# Altium project iCE_Vision.PrjPcb
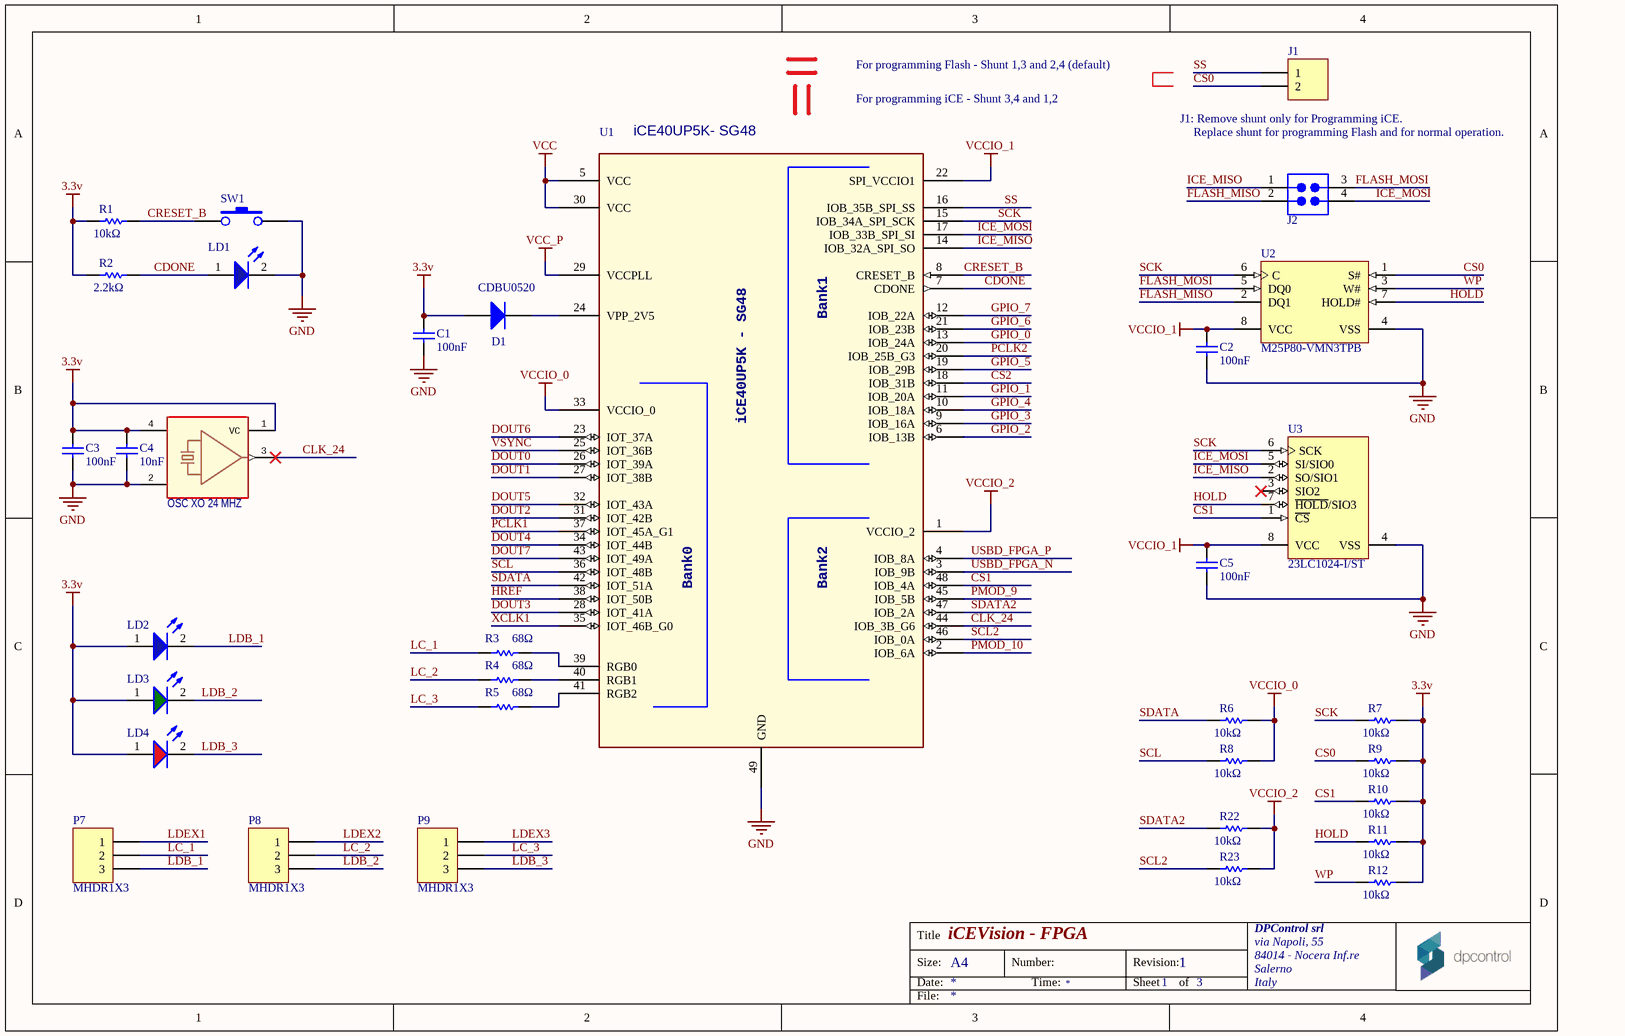
[diagram p0: FPGA.SchDoc]
Address1: via Napoli, 55
3 sheets, 106 parts. Net scope: global (net labels, ports and power ports of the same name join across sheets).
Board file: DPC_ICE_UP.PcbDoc
Sheets:
  FPGA.SchDoc
  POWER.SchDoc
  HEADER.SchDoc

## Sheet FPGA.SchDoc: iCEVision - FPGA
size A4; Organization: DPControl srl; Address1: via Napoli, 55; Address2: 84014 - Nocera Inf.re; Address3: Salerno; Address4: Italy; Revision: 1; SheetNumber: 1; SheetTotal: 3

### Parts
C1  value 100nF  [0603]  (hidden comment: C0603)
C2  value 100nF  [0603]  (hidden comment: C0603)
C3  value 100nF  [0603]  (hidden comment: C0603)
C4  value 10nF  [0603]  (hidden comment: C0603)
C5  value 100nF  [0603]  (hidden comment: C0603)
D1  value CDBU0520  [0603]  (hidden comment: Diode)
J1  WE-2.54 mm Pin Header & Jumper 61300211121  [61300211121]  (value not drawn)
J2  WE-2.54 mm Pin Header & Jumper 61300421121  [61300421121]  (value not drawn)
LD1  150060BS75000  [LED_0603_Blue]  (value not drawn)
LD2  150060BS75000  [LED_0603_Blue]  (value not drawn)
LD3  150060GS75000  [LED_0603_Green]  (value not drawn)
LD4  150060RS75000  [LED_0603_Red]  (value not drawn)
OSC1  OSC XO 24 MHZ  [3.4X2.7-4-PAD]
P7  MHDR1X3  [MHDR1X3]
P8  MHDR1X3  [MHDR1X3]
P9  MHDR1X3  [MHDR1X3]
R1  value 10kΩ  [3-0603]  (hidden comment: ERJ3EK)
R2  value 2.2kΩ  [3-0603]  (hidden comment: ERJ3EK)
R3  value 68Ω  [3-0603]  (hidden comment: ERJ3EK)
R4  value 68Ω  [3-0603]  (hidden comment: ERJ3EK)
R5  value 68Ω  [3-0603]  (hidden comment: ERJ3EK)
R6  value 10kΩ  [3-0603]  (hidden comment: ERJ3EK)
R7  value 10kΩ  [3-0603]  (hidden comment: ERJ3EK)
R8  value 10kΩ  [3-0603]  (hidden comment: ERJ3EK)
R9  value 10kΩ  [3-0603]  (hidden comment: ERJ3EK)
R10  value 10kΩ  [3-0603]  (hidden comment: ERJ3EK)
R11  value 10kΩ  [3-0603]  (hidden comment: ERJ3EK)
R12  value 10kΩ  [3-0603]  (hidden comment: ERJ3EK)
R22  value 10kΩ  [3-0603]  (hidden comment: ERJ3EK)
R23  value 10kΩ  [3-0603]  (hidden comment: ERJ3EK)
SW1  B3U-1000P  [B3U-1000P omron]  (value not drawn)
U1  iCE40UP5K- SG48
U2  M25P80-VMN3TPB  [MICT-MN-8_N]
U3  23LC1024-I/ST  [MCHP-TSSOP-ST8_N]

### Nets
3.3v: C1.2 C3.1 C4.2 D1.1(A) LD2.1(A) LD3.1(A) LD4.1(A) OSC1.1(VC) OSC1.4(VCC) R1.1 R2.1 R7.2 R9.2 R10.2 R11.2 R12.2
GND: C1.1 C2.1 C3.2 C4.1 C5.1 LD1.2(C) OSC1.2(GND) SW1.2 U1.49(GND) U2.4(VSS) U3.4(VSS)
VCC: U1.5(VCC) U1.30(VCC)
VCC_P: U1.29(VCCPLL)
VCCIO_0: R6.2 R8.2 U1.33(VCCIO_0)
VCCIO_1: C2.2 C5.2 U1.22(SPI_VCCIO1) U2.8(VCC) U3.8(VCC)
VCCIO_2: R22.2 R23.2 U1.1(VCCIO_2)
CDONE: LD1.1(A) R2.2 U1.7(CDONE)
CLK_24: OSC1.3(OUT) U1.44(IOB_3B_G6)
CRESET_B: R1.2 SW1.1 U1.8(CRESET_B)
CS0: J1.2 R9.1 U2.1(S#)
CS1: R10.1 U1.48(IOB_4A) U3.1(~{CS})
CS2: U1.18(IOB_31B)
DOUT0: U1.26(IOT_39A)
DOUT1: U1.27(IOT_38B)
DOUT2: U1.31(IOT_42B)
DOUT3: U1.28(IOT_41A)
DOUT4: U1.34(IOT_44B)
DOUT5: U1.32(IOT_43A)
DOUT6: U1.23(IOT_37A)
DOUT7: U1.43(IOT_49A)
FLASH_MISO: J2.2 U2.2(DQ1)
FLASH_MOSI: J2.3 U2.5(DQ0)
GPIO_0: U1.13(IOB_24A)
GPIO_1: U1.11(IOB_20A)
GPIO_2: U1.6(IOB_13B)
GPIO_3: U1.9(IOB_16A)
GPIO_4: U1.10(IOB_18A)
GPIO_5: U1.19(IOB_29B)
GPIO_6: U1.21(IOB_23B)
GPIO_7: U1.12(IOB_22A)
HOLD: R11.1 U2.7(HOLD#) U3.7(~{HOLD}/SIO3)
HREF: U1.38(IOT_50B)
ICE_MISO: J2.1 U1.14(IOB_32A_SPI_SO) U3.2(SO/SIO1)
ICE_MOSI: J2.4 U1.17(IOB_33B_SPI_SI) U3.5(SI/SIO0)
LC_1: P7.2 R3.1
LC_2: P8.2 R4.1
LC_3: P9.2 R5.1
LDB_1: LD2.2(C) P7.3
LDB_2: LD3.2(C) P8.3
LDB_3: LD4.2(C) P9.3
LDEX1: P7.1
LDEX2: P8.1
LDEX3: P9.1
PCLK1: U1.37(IOT_45A_G1)
PCLK2: U1.20(IOB_25B_G3)
PMOD_9: U1.45(IOB_5B)
PMOD_10: U1.2(IOB_6A)
SCK: R7.1 U1.15(IOB_34A_SPI_SCK) U2.6(C) U3.6(SCK)
SCL: R8.1 U1.36(IOT_48B)
SCL2: R23.1 U1.46(IOB_0A)
SDATA: R6.1 U1.42(IOT_51A)
SDATA2: R22.1 U1.47(IOB_2A)
SS: J1.1 U1.16(IOB_35B_SPI_SS)
USBD_FPGA_N: U1.3(IOB_9B)
USBD_FPGA_P: U1.4(IOB_8A)
VSYNC: U1.25(IOT_36B)
WP: R12.1 U2.3(W#)
XCLK1: U1.35(IOT_46B_G0)
NetD1_2: D1.2(K) U1.24(VPP_2V5)
NetR3_2: R3.2 U1.39(RGB0)
NetR4_2: R4.2 U1.40(RGB1)
NetR5_2: R5.2 U1.41(RGB2)

Not connected (* = marked no-connect by the designer): U3 3(SIO2)*

### Notes on the sheet
- For programming Flash - Shunt 1,3 and 2,4 (default)
- For programming iCE - Shunt 3,4 and 1,2
- (near J1) J1: Remove shunt only for Programming iCE.
- Replace shunt for programming Flash and for normal operation.
- Title
- Size:
- Date:
- A4
- Number:
- Time:
- Revision:
- Sheet
- of
- File:
- (in symbol iCE40UP5K- SG48) Bank1; iCE40UP5K - SG48; Bank0; Bank2

### Library data of the parts
C1-C3 C5 = C0603: Ceramic Chip Capacitor - Standard; Part No: C0603C104K8RACTU; MPN: GPC0603104; Note: Footprint corresponds to dimensions for bulk cassette packaging. This case size has tightened tolerances.; Published: 17-Jul-2002; LatestRevisionNote: Silkscreen size reduced.; DatasheetDocument: Mar-2001; PackageDocument: Mar-2001; PackageReference: 0603; Publisher: Altium Limited; Code_JEITA: 0603; Code_IPC: 1608 [0603]; ComponentLink1Description: Manufacturer Link; ComponentLink1URL: http://www.kemet.com/; ComponentLink2Description: Datasheet; ComponentLink2URL: http://www.kemet.com/kemet/web/homepage/kechome.nsf/vapubfilesname/F3102TA.pdf/$file/F3102TA.pdf
C4 = C0603: Ceramic Chip Capacitor - Standard; Part No: C0603C103K5RACTU; MPN: GPC0603103; Note: Footprint corresponds to dimensions for bulk cassette packaging. This case size has tightened tolerances.; Published: 17-Jul-2002; LatestRevisionNote: Silkscreen size reduced.; DatasheetDocument: Mar-2001; PackageDocument: Mar-2001; PackageReference: 0603; Publisher: Altium Limited; Code_JEITA: 0603; Code_IPC: 1608 [0603]; ComponentLink1Description: Manufacturer Link; ComponentLink1URL: http://www.kemet.com/; ComponentLink2Description: Datasheet; ComponentLink2URL: http://www.kemet.com/kemet/web/homepage/kechome.nsf/vapubfilesname/F3102TA.pdf/$file/F3102TA.pdf
D1 = Diode: Default Diode; Manufacturer: COMCHIP TECHNOLOGY; Published: 8-Jun-2000; LatestRevisionDate: 17-Jul-2002; LatestRevisionNote: Re-released for DXP Platform.; PackageVersion: Sep-1996; PackageReference: SOD-523F (0603); Publisher: Altium Limited; PackageDescription: SOD-523F (0603); Code_JEDEC: DO-214-AB; MPN: CDBU0520
J1 = WE-2.54 mm Pin Header & Jumper 61300211121: WR-PHD 2.54mm Pin Header; Manufacturer: W¨¹rth Elektronik eiSos GmbH; ComponentLink1 Description: Manufacturer; ComponentLink2 Description: Datasheet; NoPins: 02; Created Date: 22 March 2013; partNo: 61300211121; ComponentLink1URL: http://www.we-online.com; ComponentLink2URL: http://katalog.we-online.de/em/datasheet/6130xx11121.pdf; Created by: Karrer Zheng
J2 = WE-2.54 mm Pin Header & Jumper 61300421121: WR-PHD 2.54 mm Dual Pin Header; Manufacturer: W¨¹rth Elektronik eiSos GmbH; ComponentLink1 Description: Manufacturer; ComponentLink2 Description: Datasheet; NoPins: 04; Created Date: 25 March 2013; partNo: 61300421121; ComponentLink1URL: http://www.we-online.com; ComponentLink2URL: http://katalog.we-online.de/em/datasheet/6130xx21121.pdf; Created by: Karrer Zheng
LD1 LD2 = WL-SMCW 0603  150060BS75000: SMD mono-color Chip LED, WL-SMCW, Blue; Manufacturer: W黵th Elektronik eiSos GmbH; PartNo: 150060BS75000; ComponentLink1Description: Manufacturer; ComponentLink1URL: http://www.we-online.de; Created by: Christin Otto; Created Date: June 2013; ComponentLink2Description: Datasheet; ComponentLink2URL: http://katalog.we-online.com/led/datasheet/150060BS75000.pdf; Color: Blue; MPN: 150060BS75000
LD3 = WL-SMCW 0603  150060GS75000: SMD mono-color Chip LED, WL-SMCW, Green; Manufacturer: W黵th Elektronik eiSos GmbH; PartNo: 150060GS75000; ComponentLink1Description: Manufacturer; ComponentLink1URL: http://www.we-online.de; Created by: Christin Otto; Created Date: June 2013; ComponentLink2Description: Datasheet; ComponentLink2URL: http://katalog.we-online.com/led/datasheet/150060GS75000.pdf; Color: Green; MPN: 150060GS75000
LD4 = WL-SMCW 0603  150060RS75000: SMD mono-color Chip LED, WL-SMCW, Red; Manufacturer: W黵th Elektronik eiSos GmbH; PartNo: 150060RS75000; ComponentLink1Description: Manufacturer; ComponentLink1URL: http://www.we-online.de; Created by: Christin Otto; Created Date: June 2013; ComponentLink2Description: Datasheet; ComponentLink2URL: http://katalog.we-online.com/led/datasheet/150060RS75000.pdf; Color: Red; MPN: 150060RS75000
OSC1 = TCXO-CFPT-9301: Manufacturer: Abracon LLC; Part No: LFSPXO025558; MPN: 7M-24.000MAAJ-T; Value: ASFL1-24.000MHZ-EK-T; Supplier 1: Allied; Distributor: RS Components
P7-P9 = MHDR1X3: Header, 3-Pin; LatestRevisionDate: 17-Jul-2002; LatestRevisionNote: Re-released for DXP Platform.; Publisher: Altium Limited
R1 R6-R12 R22 R23 = ERJ3EK: Precision Thick Film Chip Resistor, 10 Ohm to 1M Ohm Range, 1% and 0.5% Tolerance, 0603 Size, 0.063 W; Part No: ERJ3EKF1002V; MPN: GPR060310K; Published: 17-Dec-2003; LatestRevisionDate: 19-Mar-2004; LatestRevisionNote: Silkscreen size reduced.; PackageDocument: Mar-2003; PackageReference: 3-0603; Publisher: Altium Limited; Code_IPC: 1608 [0603]; ComponentLink1Description: Manufacturer Link; ComponentLink1URL: http://www.panasonic.com/industrial/components/resistive_products.htm; ComponentLink2Description: Datasheet; ComponentLink2URL: http://www.panasonic.com/industrial/components/pdf/AOA0000CE2.pdf
R2 = ERJ3EK: Precision Thick Film Chip Resistor, 10 Ohm to 1M Ohm Range, 1% and 0.5% Tolerance, 0603 Size, 0.063 W; Part No: ERA3ARB222V; MPN: GPR06032K2; Published: 17-Dec-2003; LatestRevisionDate: 19-Mar-2004; LatestRevisionNote: Silkscreen size reduced.; PackageDocument: Mar-2003; PackageReference: 3-0603; Publisher: Altium Limited; Code_IPC: 1608 [0603]; ComponentLink1Description: Manufacturer Link; ComponentLink1URL: http://www.panasonic.com/industrial/components/resistive_products.htm; ComponentLink2Description: Datasheet; ComponentLink2URL: http://www.panasonic.com/industrial/components/pdf/AOA0000CE2.pdf
R3-R5 = ERJ3EK: Precision Thick Film Chip Resistor, 10 Ohm to 1M Ohm Range, 1% and 0.5% Tolerance, 0603 Size, 0.063 W; Part No: ERJPA3F68R0V; MPN: GPR060368R; LatestRevisionDate: 19-Mar-2004; LatestRevisionNote: Silkscreen size reduced.; PackageDocument: Mar-2003; PackageReference: 3-0603; Publisher: Altium Limited; Code_IPC: 1608 [0603]; ComponentLink1Description: Manufacturer Link; ComponentLink1URL: http://www.panasonic.com/industrial/components/resistive_products.htm; ComponentLink2Description: Datasheet; ComponentLink2URL: http://www.panasonic.com/industrial/components/pdf/AOA0000CE2.pdf
SW1 = SW-PB: Tact Switch; MAN: Omron; DIST: Farnell; DIST PN: 1333652RL; MAN PN: B3U-1000P; ICCO PN: B3U-1000P; MPN: B3U-1000P
U1 = iCE40UP5K- SG48: MPN: ICE40UP5K-SG48ITR50
U2 = M25P80-VMN3TPB: 8 Mb (x1) Automotive Serial NOR Flash Memory, 75 MHz, 2.7 to 3.6 V, 8-pin SO8 Narrow (MN), Tape & Reel; Part Family: M25P; Manufacturer: Micron; MPN: MX25L8006EM2I-12G; Density: 8Mb; Speed: 75 MHz; Voltage: 2.7V-3.6V; DatasheetVersion: Rev. Y; PackageVersion: Rev 11; PackageReference: MICT-MN-8; PackageDescription: 8-Pin SO Narrow, 3.9 X 4.9 mm, Pitch 1.27 mm; Applications: Automotive; Package: SO8 Narrow; Part Status: Production; RoHS: Yes; Type: Data Storage; Width: x1; Mounting Technology: Surface Mount; PartNumber: M25P80-VMN3TPB; ComponentLink1Description: Manufacturer URL; ComponentLink1URL: http://www.micron.com/; ComponentLink2Description: Datasheet; ComponentLink2URL: http://www.micron.com/~/media/Documents/Products/Data%20Sheet/NOR%20Flash/Serial%20NOR/M25P/M25P80.pdf; ComponentLink3Description: Package Specification; ComponentLink3URL: http://www.micron.com/~/media/Documents/Products/Data%20Sheet/NOR%20Flash/Serial%20NOR/M25P/M25P05A.pdf
U3 = 23LC1024-I/ST: 1024K bits SPI Serial SRAM with SDI and SQI Interface, 2.5 to 5.5 V, 20 MHz, -40 to 85 degC, 8-pin TSSOP (ST8), Tube; Manufacturer: Microchip; DatasheetVersion: Rev. A; PackageVersion: C04-086B; PackageReference: TSSOP-ST8; PackageDescription: 8-Lead Plastic Thin Shrink Small Outline, 3 x 4.4 mm Body, 0.65 mm Pitch; Supplier 1: Digi-Key; Supplier Part Number 1: 23LC1024-I/ST-ND; Supplier 2: Farnell; Supplier Part Number 2: 2212151; Supplier 3: Newark; Supplier Part Number 3: 94T8232; Supplier 4: Newark; Supplier Part Number 4: 45W1402; Supplier 5: Mouser; Supplier Part Number 5: 579-23LC1024-I/ST; Mounting Technology: Surface Mount; PartNumber: 23LC1024-I/ST; ComponentLink1Description: Manufacturer URL; ComponentLink1URL: http://www.microchip.com; ComponentLink2Description: Datasheet; ComponentLink2URL: http://ww1.microchip.com/downloads/en/DeviceDoc/25142A.pdf; ComponentLink3Description: Package Specification; ComponentLink3URL: http://www.microchip.com/stellent/groups/techpub_sg/documents/packagingspec/en012702.pdf; ComponentLink4Description: Product URL; ComponentLink4URL: http://www.microchip.com/23LC1024; MPN: 23LC1024-I/ST

## Sheet POWER.SchDoc: iCEVision - Power
size A4; Organization: DPControl srl; Address1: via Napoli, 55; Address2: 84014 - Nocera Inf.re; Address3: Salerno; Address4: Italy; Revision: 1; SheetNumber: 2; SheetTotal: 3
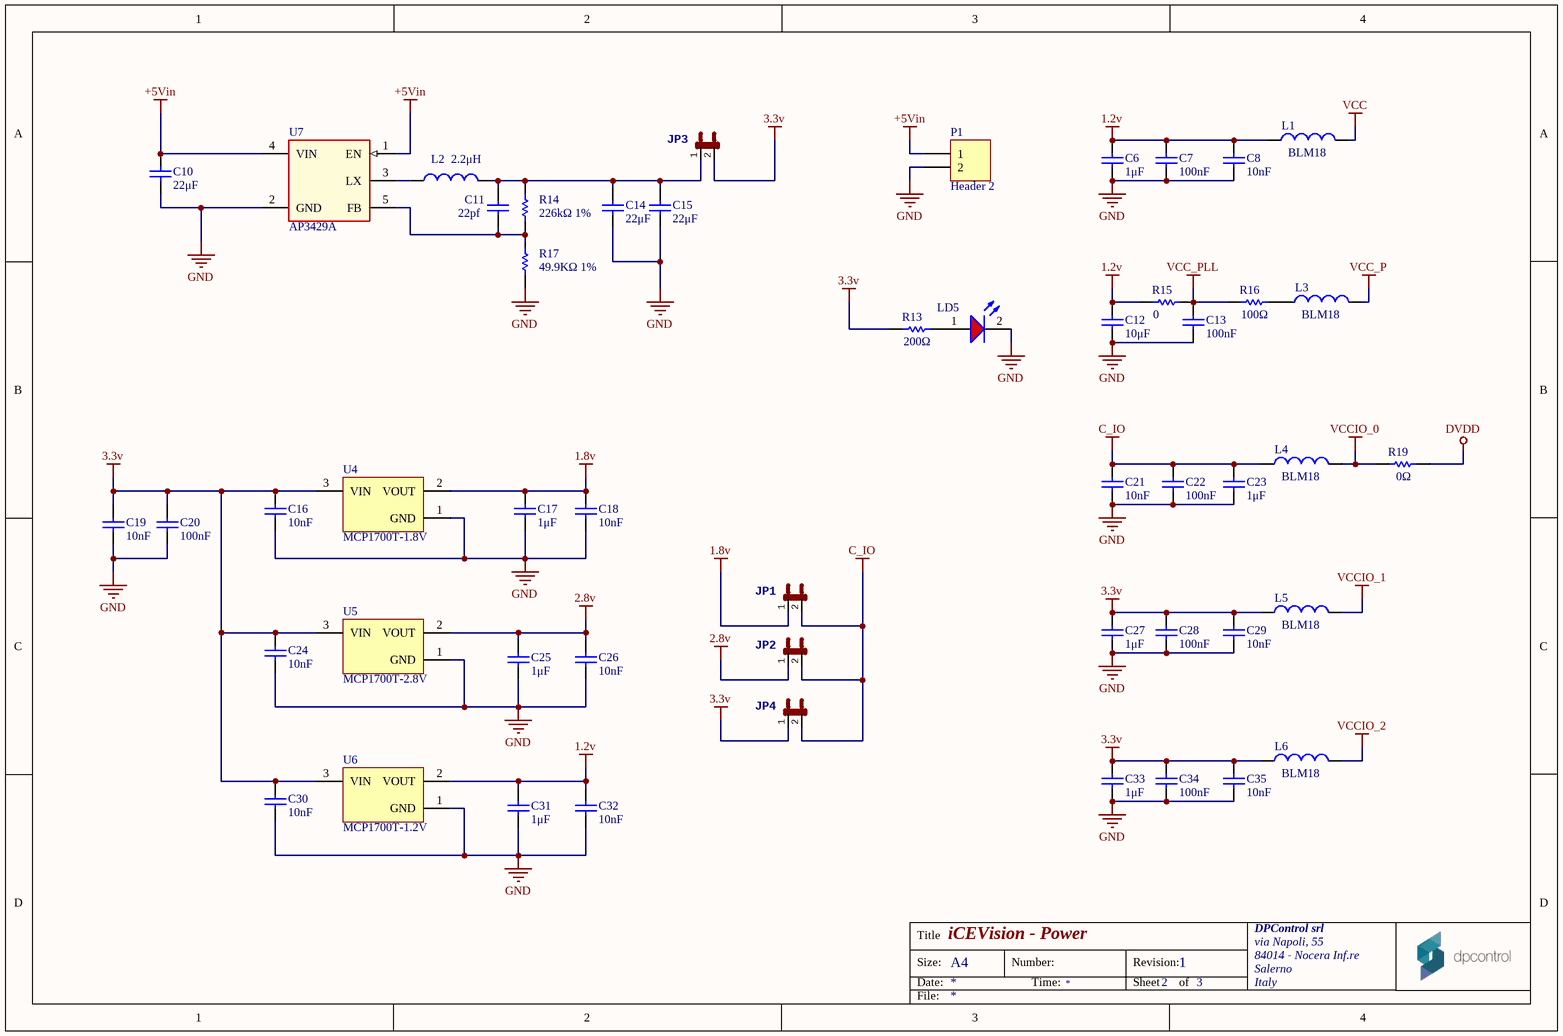
[diagram p1: POWER.SchDoc]

### Parts
C6  value 1μF  [0603]  (hidden comment: C0603)
C7  value 100nF  [0603]  (hidden comment: C0603)
C8  value 10nF  [0603]  (hidden comment: C0603)
C10  value 22μF  [0603]  (hidden comment: C0603)
C11  value 22pf  [0603]  (hidden comment: C0603)
C12  value 10μF  [0603]  (hidden comment: C0603)
C13  value 100nF  [0603]  (hidden comment: C0603)
C14  value 22μF  [0603]  (hidden comment: C0603)
C15  value 22μF  [0603]  (hidden comment: C0603)
C16  value 10nF  [0603]  (hidden comment: C0603)
C17  value 1μF  [0603]  (hidden comment: C0603)
C18  value 10nF  [0603]  (hidden comment: C0603)
C19  value 10nF  [0603]  (hidden comment: C0603)
C20  value 100nF  [0603]  (hidden comment: C0603)
C21  value 10nF  [0603]  (hidden comment: C0603)
C22  value 100nF  [0603]  (hidden comment: C0603)
C23  value 1μF  [0603]  (hidden comment: C0603)
C24  value 10nF  [0603]  (hidden comment: C0603)
C25  value 1μF  [0603]  (hidden comment: C0603)
C26  value 10nF  [0603]  (hidden comment: C0603)
C27  value 1μF  [0603]  (hidden comment: C0603)
C28  value 100nF  [0603]  (hidden comment: C0603)
C29  value 10nF  [0603]  (hidden comment: C0603)
C30  value 10nF  [0603]  (hidden comment: C0603)
C31  value 1μF  [0603]  (hidden comment: C0603)
C32  value 10nF  [0603]  (hidden comment: C0603)
C33  value 1μF  [0603]  (hidden comment: C0603)
C34  value 100nF  [0603]  (hidden comment: C0603)
C35  value 10nF  [0603]  (hidden comment: C0603)
JP1  JUMPER  [JP1]  (value not drawn)
JP2  JUMPER  [JP1]  (value not drawn)
JP3  JUMPER  [JP1]  (value not drawn)
JP4  JUMPER  [JP1]  (value not drawn)
L1  BLM18  [0603]
L2  value 2.2μH  [INDC2520X100]  (hidden comment: 1239AS-H-2R2M=P2)
L3  BLM18  [0603]
L4  BLM18  [0603]
L5  BLM18  [0603]
L6  BLM18  [0603]
LD5  150060RS75000  [LED_0603_Red]  (value not drawn)
P1  Header 2  [HDR1X2]
R13  value 200Ω  [3-0603]  (hidden comment: ERJ3EK)
R14  value 226kΩ 1%  [3-0603]
R15  value 0  [3-0603]  (hidden comment: ERJ3EK)
R16  value 100Ω  [3-0603]  (hidden comment: ERJ3EK)
R17  value 49.9KΩ 1%  [3-0603]  (hidden comment: ERJ3EK)
R19  value 0Ω  [3-0603]  (hidden comment: ERJ3EK)
U4  MCP1700T-1.8V  [SOT-23-TT3_N]
U5  MCP1700T-2.8V  [SOT-23-TT3_N]
U6  MCP1700T-1.2V  [SOT-23-TT3_N]
U7  AP3429A  [SOT-23-5]

### Nets
1.2v: C6.2 C7.2 C8.2 C12.2 C31.2 C32.2 L1.1 R15.1 U6.2(VOUT)
1.8v: C17.2 C18.2 JP1.1 U4.2(VOUT)
2.8v: C25.2 C26.2 JP2.1 U5.2(VOUT)
3.3v: C16.2 C19.2 C20.2 C24.2 C27.2 C28.2 C29.2 C30.2 C33.2 C34.2 C35.2 JP3.2 JP4.1 L5.1 L6.1 R13.1 U4.3(VIN) U5.3(VIN) U6.3(VIN)
+5Vin: C10.2 P1.1 U7.1(EN) U7.4(VIN)
C_IO: C21.2 C22.2 C23.2 JP1.2 JP2.2 JP4.2 L4.1
DVDD: R19.2
GND: C6.1 C7.1 C8.1 C10.1 C12.1 C13.1 C14.1 C15.1 C16.1 C17.1 C18.1 C19.1 C20.1 C21.1 C22.1 C23.1 C24.1 C25.1 C26.1 C27.1 C28.1 C29.1 C30.1 C31.1 C32.1 C33.1 C34.1 C35.1 LD5.2(C) P1.2 R17.2 U4.1(GND) U5.1(GND) U6.1(GND) U7.2(GND)
VCC: L1.2
VCC_P: L3.2
VCC_PLL: C13.2 R15.2 R16.1
VCCIO_0: L4.2 R19.1
VCCIO_1: L5.2
VCCIO_2: L6.2
NetC11_1: C11.1 R14.1 R17.1 U7.5(FB)
NetC11_2: C11.2 C14.2 C15.2 JP3.1 L2.2 R14.2
NetL2_1: L2.1 U7.3(LX)
NetL3_1: L3.1 R16.2
NetLD5_1: LD5.1(A) R13.2

### Notes on the sheet
- Title
- Size:
- Date:
- A4
- Number:
- Time:
- Revision:
- Sheet
- of
- File:

### Library data of the parts
C6 C17 C23 C25 C27 C31 C33 = C0603: Ceramic Chip Capacitor - Standard; Part No: C0603C105K8PACTU; MPN: GPC0603105; Note: Footprint corresponds to dimensions for bulk cassette packaging. This case size has tightened tolerances.; Published: 17-Jul-2002; LatestRevisionNote: Silkscreen size reduced.; DatasheetDocument: Mar-2001; PackageDocument: Mar-2001; PackageReference: 0603; Publisher: Altium Limited; Code_JEITA: 0603; Code_IPC: 1608 [0603]; ComponentLink1Description: Manufacturer Link; ComponentLink1URL: http://www.kemet.com/; ComponentLink2Description: Datasheet; ComponentLink2URL: http://www.kemet.com/kemet/web/homepage/kechome.nsf/vapubfilesname/F3102TA.pdf/$file/F3102TA.pdf
C7 C13 C20 C22 C28 C34 = C0603: as C1 on sheet FPGA; Published: 17-Jul-2002; LatestRevisionNote: Silkscreen size reduced.; DatasheetDocument: Mar-2001; PackageDocument: Mar-2001; PackageReference: 0603; Publisher: Altium Limited; Code_JEITA: 0603; Code_IPC: 1608 [0603]; ComponentLink1Description: Manufacturer Link; ComponentLink1URL: http://www.kemet.com/; ComponentLink2Description: Datasheet; ComponentLink2URL: http://www.kemet.com/kemet/web/homepage/kechome.nsf/vapubfilesname/F3102TA.pdf/$file/F3102TA.pdf
C8 C16 C18 C19 C21 C24 C26 C29 C30 C32 C35 = C0603: as C4 on sheet FPGA; Published: 17-Jul-2002; LatestRevisionNote: Silkscreen size reduced.; DatasheetDocument: Mar-2001; PackageDocument: Mar-2001; PackageReference: 0603; Publisher: Altium Limited; Code_JEITA: 0603; Code_IPC: 1608 [0603]; ComponentLink1Description: Manufacturer Link; ComponentLink1URL: http://www.kemet.com/; ComponentLink2Description: Datasheet; ComponentLink2URL: http://www.kemet.com/kemet/web/homepage/kechome.nsf/vapubfilesname/F3102TA.pdf/$file/F3102TA.pdf
C10 C14 C15 = C0603: Ceramic Chip Capacitor - Standard; MPN: CC0603MRX5R5BB226; Manufacturer: Yageo; Code_IPC: 1608 [0603]; Supplier 1: Future Electronics; Supplier Part Number 1: 5052545
C11 = C0603: Ceramic Chip Capacitor - Standard; Manufacturer: Vishay; MPN: VJ0603A220JXACW1BC
C12 = C0603: Ceramic Chip Capacitor - Standard; Part No: C0603C106M9PACTU; MPN: GRM219R60J106KE19D; Note: Footprint corresponds to dimensions for bulk cassette packaging. This case size has tightened tolerances.; Published: 17-Jul-2002; LatestRevisionNote: Silkscreen size reduced.; DatasheetDocument: Mar-2001; PackageDocument: Mar-2001; PackageReference: 0603; Publisher: Altium Limited; Code_JEITA: 0603; Code_IPC: 1608 [0603]; ComponentLink1Description: Manufacturer Link; ComponentLink1URL: http://www.kemet.com/; ComponentLink2Description: Datasheet; ComponentLink2URL: http://www.kemet.com/kemet/web/homepage/kechome.nsf/vapubfilesname/F3102TA.pdf/$file/F3102TA.pdf
JP1-JP4 = JP1E
L1 L3-L6 = Inductor1: Inductor; Value: BLM18HE601SN1D; Supplier 1: Digi-Key; Supplier Part Number 2: 490-5214-2-ND; MPN: BLM18HE601SN1D
  L1: Part No: BLM18HE601SN1D
L2 = Inductor1: Inductor; MPN: 1239AS-H-2R2M=P2
LD5 = WL-SMCW 0603  150060RS75000: as LD4 on sheet FPGA; PartNo: 150060RS75000; ComponentLink1Description: Manufacturer; ComponentLink1URL: http://www.we-online.de; Created by: Christin Otto; Created Date: June 2013; ComponentLink2Description: Datasheet; ComponentLink2URL: http://katalog.we-online.com/led/datasheet/150060RS75000.pdf; Color: Red; MPN: 150060RS75000
P1 = Header 2: Header, 2-Pin; LatestRevisionDate: 17-Jul-2002; LatestRevisionNote: Re-released for DXP Platform.; Publisher: Altium Limited
R13 = ERJ3EK: Precision Thick Film Chip Resistor, 10 Ohm to 1M Ohm Range, 1% and 0.5% Tolerance, 0603 Size, 0.063 W; Part No: ERA3AEB201V; MPN: GPR0603200R; LatestRevisionDate: 19-Mar-2004; LatestRevisionNote: Silkscreen size reduced.; PackageDocument: Mar-2003; PackageReference: 3-0603; Publisher: Altium Limited; Code_IPC: 1608 [0603]; ComponentLink1Description: Manufacturer Link; ComponentLink1URL: http://www.panasonic.com/industrial/components/resistive_products.htm; ComponentLink2Description: Datasheet; ComponentLink2URL: http://www.panasonic.com/industrial/components/pdf/AOA0000CE2.pdf
R14 = ERJ3EK: 226k ohm 1% Tolerance, 0603 Size, 0.063 W; MPN: CRCW0603226KFKEA; MF: Vishay
R15 = ERJ3EK: Precision Thick Film Chip Resistor, 10 Ohm to 1M Ohm Range, 1% and 0.5% Tolerance, 0603 Size, 0.063 W; Part No: ERJ-3GEY0R00V; MPN: CRCW06030000Z0EA; LatestRevisionDate: 19-Mar-2004; LatestRevisionNote: Silkscreen size reduced.; PackageDocument: Mar-2003; PackageReference: 3-0603; Publisher: Altium Limited; Code_IPC: 1608 [0603]; ComponentLink1Description: Manufacturer Link; ComponentLink1URL: http://www.panasonic.com/industrial/components/resistive_products.htm; ComponentLink2Description: Datasheet; ComponentLink2URL: http://www.panasonic.com/industrial/components/pdf/AOA0000CE2.pdf
R16 = ERJ3EK: Precision Thick Film Chip Resistor, 10 Ohm to 1M Ohm Range, 1% and 0.5% Tolerance, 0603 Size, 0.063 W; Part No: ERA3AEB101V; MPN: GPR0603100R; LatestRevisionDate: 19-Mar-2004; LatestRevisionNote: Silkscreen size reduced.; PackageDocument: Mar-2003; PackageReference: 3-0603; Publisher: Altium Limited; Code_IPC: 1608 [0603]; ComponentLink1Description: Manufacturer Link; ComponentLink1URL: http://www.panasonic.com/industrial/components/resistive_products.htm; ComponentLink2Description: Datasheet; ComponentLink2URL: http://www.panasonic.com/industrial/components/pdf/AOA0000CE2.pdf
R17 = ERJ3EK: Precision Thick Film Chip Resistor, 10 Ohm to 1M Ohm Range, 1% and 0.5% Tolerance, 0603 Size, 0.063 W; Part No: ERJ3EKF1002V; MPN: CRCW060349K9FKEA; Published: 17-Dec-2003; LatestRevisionDate: 19-Mar-2004; LatestRevisionNote: Silkscreen size reduced.; PackageReference: 3-0603; Publisher: Altium Limited; PackageDocument: Mar-2003; Code_IPC: 1608 [0603]; ComponentLink1Description: Manufacturer Link; ComponentLink1URL: http://www.panasonic.com/industrial/components/resistive_products.htm; ComponentLink2Description: Datasheet; ComponentLink2URL: http://www.panasonic.com/industrial/components/pdf/AOA0000CE2.pdf
R19 = ERJ3EK: Precision Thick Film Chip Resistor, 10 Ohm to 1M Ohm Range, 1% and 0.5% Tolerance, 0603 Size, 0.063 W; Part No: ERJ3GEY0R00V; MPN: CRCW06030000Z0EA; Published: 17-Dec-2003; LatestRevisionDate: 19-Mar-2004; LatestRevisionNote: Silkscreen size reduced.; PackageDocument: Mar-2003; PackageReference: 3-0603; Publisher: Altium Limited; Code_IPC: 1608 [0603]; ComponentLink1Description: Manufacturer Link; ComponentLink1URL: http://www.panasonic.com/industrial/components/resistive_products.htm; ComponentLink2Description: Datasheet; ComponentLink2URL: http://www.panasonic.com/industrial/components/pdf/AOA0000CE2.pdf
U4 = MCP1700T-5002E/TT: Low Quiescent Current LDO, 3-Pin SOT-23, Extended Temperature, Tape and Reel; Part No: MCP1700T-1802E/TT:1.8V; Manufacturer: Microchip; Value: MCP1700T-1802E/TT; PackageReference: SOT-23-TT3; Code_IPC: SOT23-3; Datasheet: http://docs-europe.electrocomponents.com/webdocs/137e/0900766b8137eadc.pdf; MPN: MCP1700T-1802E/TT
U5 = MCP1700T-5002E/TT: Low Quiescent Current LDO, 3-Pin SOT-23, Extended Temperature, Tape and Reel; Part No: MCP1700T-2802E/TT:2.8V; Manufacturer: Microchip; Value: MCP1700T-2802E/TT; PackageReference: SOT-23-TT3; Code_IPC: SOT23-3; Datasheet: http://docs-europe.electrocomponents.com/webdocs/137e/0900766b8137eadc.pdf; MPN: MCP1700T-2802E/TT
U6 = MCP1700T-5002E/TT: Low Quiescent Current LDO, 3-Pin SOT-23, Extended Temperature, Tape and Reel; Part No: MCP1700T-1202E/TT:1.2V; Manufacturer: Microchip; Value: MCP1700T-1202E/TT; PackageReference: SOT-23-TT3; Code_IPC: SOT23-3; Datasheet: http://docs-europe.electrocomponents.com/webdocs/137e/0900766b8137eadc.pdf; MPN: MCP1700T-1202E/TT
U7 = AP3429A: MPN: AP3429AKTTR-G1; Supplier 1: Digi-Key; Supplier Part Number 1: AP3429AKTTR-G1DICT-ND

## Sheet HEADER.SchDoc: iCEVision - Headers
size A4; Organization: DPControl srl; Address1: via Napoli, 55; Address2: 84014 - Nocera Inf.re; Address3: Salerno; Address4: Italy; Revision: 1; SheetNumber: 3; SheetTotal: 3
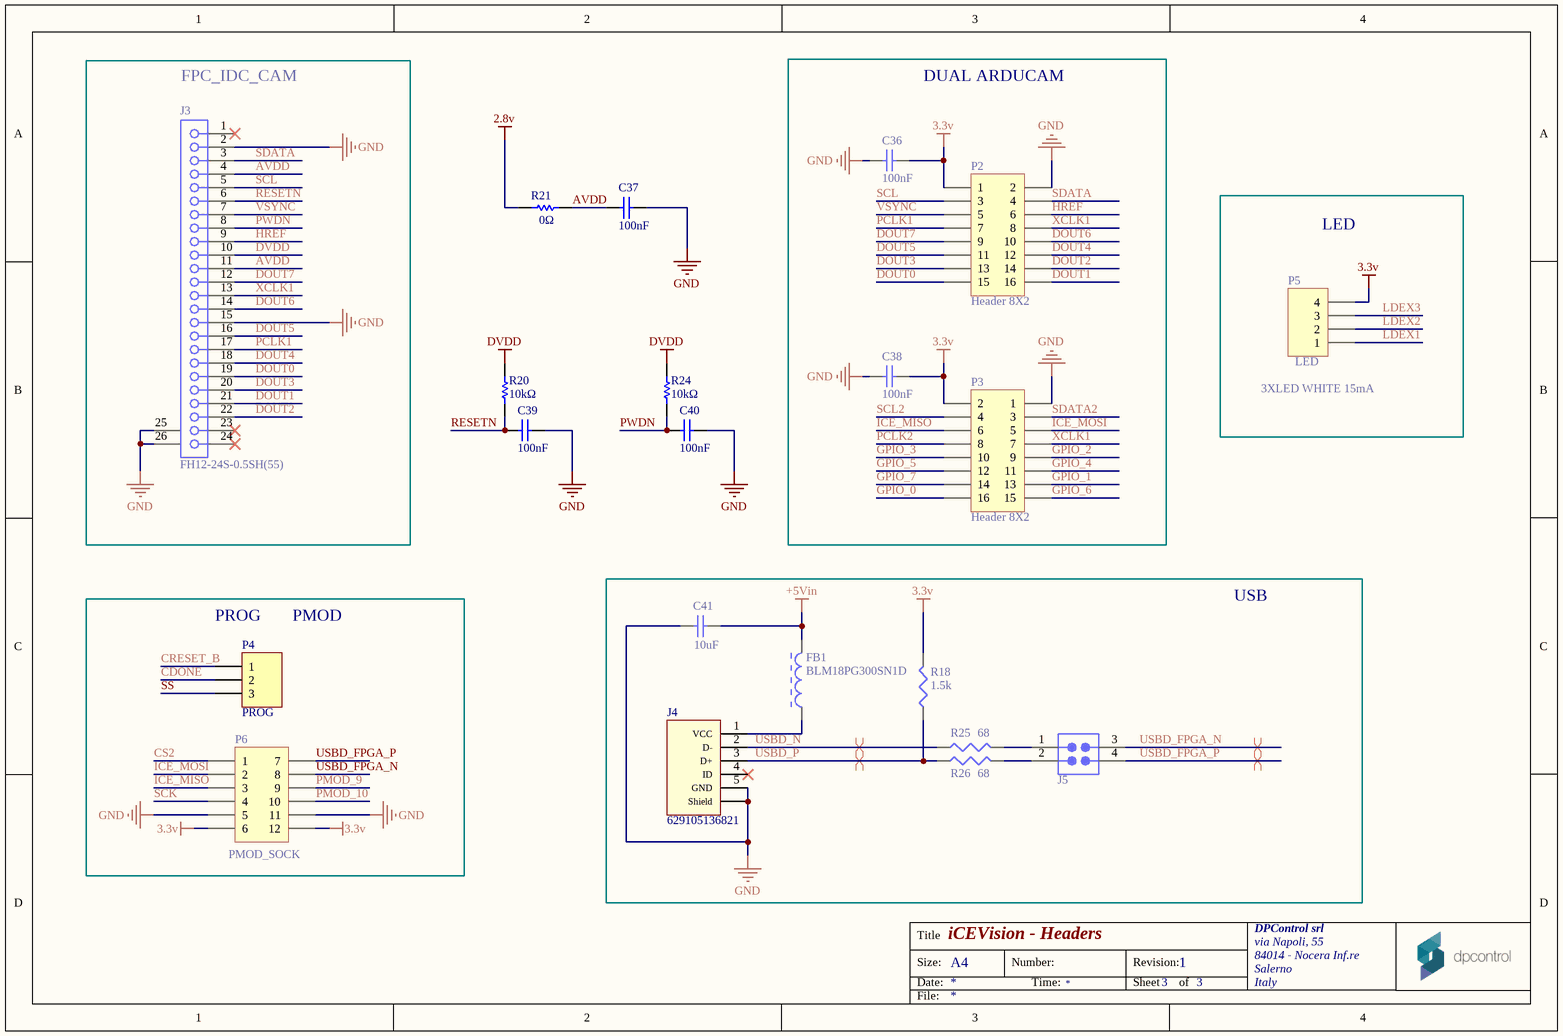
[diagram p2: HEADER.SchDoc]

### Parts
C36  value 100nF  [0603]  (hidden comment: C0603)
C37  value 100nF  [0603]  (hidden comment: C0603)
C38  value 100nF  [0603]  (hidden comment: C0603)
C39  value 100nF  [0603]  (hidden comment: C0603)
C40  value 100nF  [0603]  (hidden comment: C0603)
C41  value 10uF  [C1206]  (hidden comment: Cap Semi)
FB1  BLM18PG300SN1D  [MURA-BLM18PG_KG-CHIP-2_V1]
J3  FH12-24S-0.5SH(55)  [FH12-24S-0.5SH]
J4  629105136821  [629105136821]
J5  WE-2.54 mm Pin Header & Jumper 61300421121  [61300421121]  (value not drawn)
P2  Header 8X2  [HDR2X8]
P3  Header 8X2  [HDR2X8]
P4  PROG  [HDR1X3]
P5  LED  [MHDR1X4]
P6  PMOD_SOCK  [HDR2X6_CEN]
R18  value 1.5k  [J1-0603]  (hidden comment: Res3)
R20  value 10kΩ  [3-0603]  (hidden comment: ERJ3EK)
R21  value 0Ω  [3-0603]  (hidden comment: ERJ3EK)
R24  value 10kΩ  [3-0603]  (hidden comment: ERJ3EK)
R25  value 68  [J1-0603]  (hidden comment: Res3)
R26  value 68  [J1-0603]  (hidden comment: Res3)

### Blocks framed on the sheet
FPC_IDC_CAM: J3
DUAL ARDUCAM: C36 C38 P2 P3
LED: P5
PROG       PMOD: P4 P6
USB: C41 FB1 J4 J5 R18 R25 R26

### Nets
2.8v: R21.1
3.3v: C36.1 C38.1 P2.1 P3.2 P5.4 P6.6 P6.12 R18.2
+5Vin: C41.2 FB1.2
DVDD: J3.10 R20.2 R24.2
GND: C36.2 C37.1 C38.2 C39.1 C40.1 C41.1 J3.2 J3.15 J3.25(MH1) J3.26(MH2) J4.5(GND) J4.Shell(Shield) P2.2 P3.1 P6.5 P6.11
AVDD: C37.2 J3.4 J3.11 R21.2
CDONE: P4.2
CRESET_B: P4.1
CS2: P6.1
DOUT0: J3.19 P2.15
DOUT1: J3.21 P2.16
DOUT2: J3.22 P2.14
DOUT3: J3.20 P2.13
DOUT4: J3.18 P2.12
DOUT5: J3.16 P2.11
DOUT6: J3.14 P2.10
DOUT7: J3.12 P2.9
GPIO_0: P3.16
GPIO_1: P3.13
GPIO_2: P3.9
GPIO_3: P3.10
GPIO_4: P3.11
GPIO_5: P3.12
GPIO_6: P3.15
GPIO_7: P3.14
HREF: J3.9 P2.6
ICE_MISO: P3.6 P6.3
ICE_MOSI: P3.5 P6.2
LDEX1: P5.1
LDEX2: P5.2
LDEX3: P5.3
PCLK1: J3.17 P2.7
PCLK2: P3.8
PMOD_9: P6.9
PMOD_10: P6.10
PWDN: C40.2 J3.8 R24.1
RESETN: C39.2 J3.6 R20.1
SCK: P6.4
SCL: J3.5 P2.3
SCL2: P3.4
SDATA: J3.3 P2.4
SDATA2: P3.3
SS: P4.3
USBD_FPGA_N: J5.3 P6.8
USBD_FPGA_P: J5.4 P6.7
USBD_N: J4.2(D-) R25.1
USBD_P: J4.3(D+) R18.1 R26.1
VSYNC: J3.7 P2.5
XCLK1: J3.13 P2.8 P3.7
NetFB1_1: FB1.1 J4.1(VCC)
NetJ5_1: J5.1 R25.2
NetJ5_2: J5.2 R26.2

Not connected (* = marked no-connect by the designer): J3 1* 23* 24*; J4 4(ID)*

### Layout directives
differential pair: USBD_FPGA_N, USBD_FPGA_P, USBD_N, USBD_P

### Notes on the sheet
- (near P5) 3XLED WHITE 15mA
- Title
- Size:
- Date:
- A4
- Number:
- Time:
- Revision:
- Sheet
- of
- File:

### Library data of the parts
C36-C40 = C0603: as C1 on sheet FPGA; Published: 17-Jul-2002; LatestRevisionNote: Silkscreen size reduced.; DatasheetDocument: Mar-2001; PackageDocument: Mar-2001; PackageReference: 0603; Publisher: Altium Limited; Code_JEITA: 0603; Code_IPC: 1608 [0603]; ComponentLink1Description: Manufacturer Link; ComponentLink1URL: http://www.kemet.com/; ComponentLink2Description: Datasheet; ComponentLink2URL: http://www.kemet.com/kemet/web/homepage/kechome.nsf/vapubfilesname/F3102TA.pdf/$file/F3102TA.pdf
C41 = Cap Semi: Capacitor (Semiconductor SIM Model); MPN: 1206ZD106KAT2A; Published: 8-Jun-2000; LatestRevisionDate: 29-May-2009; LatestRevisionNote: IPC-7351 Footprint Added.; PackageReference: C1206; Publisher: Altium Limited; PackageDescription: Chip Capacitor
FB1 = CMP-0686-00572-2: Chip Ferrite Bead for Power Lines, 30 Ohm, 1000 mA, -55 to 125 degC, 1.6 x 0.8 x 0.95 mm SMD, Tape and Reel; Manufacturer: Murata; DC Resistance: 0.05 Ohm Max.; Impedance (at 100 MHz): 30 Ohm Typ.; Rated Current: 1000 mA; ComponentLink1Description: Manufacturer URL; Packing: Tape and Reel; ComponentLink2URL: http://www.murata.com/products/catalog/pdf/c31e.pdf; DatasheetVersion: 08/2013; PartNumber: BLM18PG300SN1D; Mounting Technology: Surface Mount; ComponentLink2Description: Datasheet; PackageReference: BLM18_H950-2; Operating Temperature Range: -55 to 125 degC; ComponentLink3Description: Package Specification; PackageDescription: 2-Pin Chip, Body 1.6 x 0.8 mm; ComponentLink1URL: http://www.murata.com/; ComponentLink3URL: http://www.murata.com/products/catalog/pdf/c31e.pdf; MPN: BLM18PG300SN1D
J3 = CL586-0521-0: FH12 Series, "Flip-Lock" SMT/ZIF FFC/FPC Connector - 0.5mm Spaced Bottom Contact; MPN: FH12A-24S-0.5SH(55); Positions: 24; ContactMaterial: Phosphor Bronze; Current: 0.4A; PCB_Layout: Complies with manufacturer's recommendation.; Published: 17-Jul-2002; DatasheetVersion: 13-Nov-2000; PackageVersion: 13-Nov-2000; PackageReference: FH12-24S-0.5SH; Publisher: Altium Limited; PadDimensions: Follow nominal values, Suitable for Wave Soldering, Adjust for Re-flow.; ComponentLink1Description: Manufacturer Link; ComponentLink1URL: http://www.hiroseusa.com/; ComponentLink2Description: Datasheet; ComponentLink2URL: http://www.hirose.co.jp/cataloge_hp/e58605370.pdf
J4 = 629105136821: Micro USB 2.0 SMT Type B Horizontal 5 Contacts WR-COM; Interface Type: Type B; Gender: Receptacle; ComponentLink1Description: Manufacturer; ComponentLink1URL: http://www.we-online.de; ComponentLink2Description: Datasheet; ComponentLink2URL: http://katalog.we-online.de/em/datasheet/629105136821.pdf; Part Number: 629105136821; Published Date: April 2017; Publisher: Wurth Elektronik; Sub-Family: Micro USB 2.0; Type: Horizontal; Construction: SMT; MPN: 629105136821
J5 = WE-2.54 mm Pin Header & Jumper 61300421121: as J2 on sheet FPGA; Created Date: 25 March 2013; partNo: 61300421121; ComponentLink1URL: http://www.we-online.com; ComponentLink2URL: http://katalog.we-online.de/em/datasheet/6130xx21121.pdf; Created by: Karrer Zheng
P2 P3 = Header 8X2: Header, 8-Pin, Dual row; LatestRevisionDate: 17-Jul-2002; LatestRevisionNote: Re-released for DXP Platform.; Publisher: Altium Limited
P4 = Header 3: Header, 3-Pin; LatestRevisionDate: 17-Jul-2002; LatestRevisionNote: Re-released for DXP Platform.; Publisher: Altium Limited
P5 = MHDR1X4: Header, 4-Pin; LatestRevisionDate: 17-Jul-2002; LatestRevisionNote: Re-released for DXP Platform.; Publisher: Altium Limited
P6 = Header 6X2A: Header, 6-Pin, Dual row; LatestRevisionDate: 17-Jul-2002; LatestRevisionNote: Re-released for DXP Platform.; Publisher: Altium Limited; Supplier 1: Digi-Key; Supplier Part Number 1: WM8236-ND
R18 = Res3: Resistor; MPN: GPR06031K5; Published: 8-Jun-2000; LatestRevisionDate: 29-May-2009; LatestRevisionNote: IPC-7351 Footprint Added.; PackageReference: J1-0603; Publisher: Altium Limited; PackageDescription: Chip Resistor
R20 R24 = ERJ3EK: as R1 on sheet FPGA; Published: 17-Dec-2003; LatestRevisionDate: 19-Mar-2004; LatestRevisionNote: Silkscreen size reduced.; PackageDocument: Mar-2003; PackageReference: 3-0603; Publisher: Altium Limited; Code_IPC: 1608 [0603]; ComponentLink1Description: Manufacturer Link; ComponentLink1URL: http://www.panasonic.com/industrial/components/resistive_products.htm; ComponentLink2Description: Datasheet; ComponentLink2URL: http://www.panasonic.com/industrial/components/pdf/AOA0000CE2.pdf
R21 = ERJ3EK: as R19 on sheet POWER; Published: 17-Dec-2003; LatestRevisionDate: 19-Mar-2004; LatestRevisionNote: Silkscreen size reduced.; PackageDocument: Mar-2003; PackageReference: 3-0603; Publisher: Altium Limited; Code_IPC: 1608 [0603]; ComponentLink1Description: Manufacturer Link; ComponentLink1URL: http://www.panasonic.com/industrial/components/resistive_products.htm; ComponentLink2Description: Datasheet; ComponentLink2URL: http://www.panasonic.com/industrial/components/pdf/AOA0000CE2.pdf
R25 R26 = Res3: Resistor; MPN: GPR060368R; Published: 8-Jun-2000; LatestRevisionDate: 29-May-2009; LatestRevisionNote: IPC-7351 Footprint Added.; PackageReference: J1-0603; Publisher: Altium Limited; PackageDescription: Chip Resistor

## Nets that join several sheets
2.8v: POWER (C25.2 C26.2 JP2.1 U5.2), HEADER (R21.1)
3.3v: FPGA (16 pins), POWER (19 pins), HEADER (8 pins)
+5Vin: POWER (C10.2 P1.1 U7.1 U7.4), HEADER (C41.2 FB1.2)
DVDD: POWER (R19.2), HEADER (J3.10 R20.2 R24.2)
GND: FPGA (11 pins), POWER (35 pins), HEADER (16 pins)
VCC: FPGA (U1.5 U1.30), POWER (L1.2)
VCC_P: FPGA (U1.29), POWER (L3.2)
VCCIO_0: FPGA (R6.2 R8.2 U1.33), POWER (L4.2 R19.1)
VCCIO_1: FPGA (5 pins), POWER (L5.2)
VCCIO_2: FPGA (R22.2 R23.2 U1.1), POWER (L6.2)
CDONE: FPGA (LD1.1 R2.2 U1.7), HEADER (P4.2)
CRESET_B: FPGA (R1.2 SW1.1 U1.8), HEADER (P4.1)
CS2: FPGA (U1.18), HEADER (P6.1)
DOUT0: FPGA (U1.26), HEADER (J3.19 P2.15)
DOUT1: FPGA (U1.27), HEADER (J3.21 P2.16)
DOUT2: FPGA (U1.31), HEADER (J3.22 P2.14)
DOUT3: FPGA (U1.28), HEADER (J3.20 P2.13)
DOUT4: FPGA (U1.34), HEADER (J3.18 P2.12)
DOUT5: FPGA (U1.32), HEADER (J3.16 P2.11)
DOUT6: FPGA (U1.23), HEADER (J3.14 P2.10)
DOUT7: FPGA (U1.43), HEADER (J3.12 P2.9)
GPIO_0: FPGA (U1.13), HEADER (P3.16)
GPIO_1: FPGA (U1.11), HEADER (P3.13)
GPIO_2: FPGA (U1.6), HEADER (P3.9)
GPIO_3: FPGA (U1.9), HEADER (P3.10)
GPIO_4: FPGA (U1.10), HEADER (P3.11)
GPIO_5: FPGA (U1.19), HEADER (P3.12)
GPIO_6: FPGA (U1.21), HEADER (P3.15)
GPIO_7: FPGA (U1.12), HEADER (P3.14)
HREF: FPGA (U1.38), HEADER (J3.9 P2.6)
ICE_MISO: FPGA (J2.1 U1.14 U3.2), HEADER (P3.6 P6.3)
ICE_MOSI: FPGA (J2.4 U1.17 U3.5), HEADER (P3.5 P6.2)
LDEX1: FPGA (P7.1), HEADER (P5.1)
LDEX2: FPGA (P8.1), HEADER (P5.2)
LDEX3: FPGA (P9.1), HEADER (P5.3)
PCLK1: FPGA (U1.37), HEADER (J3.17 P2.7)
PCLK2: FPGA (U1.20), HEADER (P3.8)
PMOD_9: FPGA (U1.45), HEADER (P6.9)
PMOD_10: FPGA (U1.2), HEADER (P6.10)
SCK: FPGA (R7.1 U1.15 U2.6 U3.6), HEADER (P6.4)
SCL: FPGA (R8.1 U1.36), HEADER (J3.5 P2.3)
SCL2: FPGA (R23.1 U1.46), HEADER (P3.4)
SDATA: FPGA (R6.1 U1.42), HEADER (J3.3 P2.4)
SDATA2: FPGA (R22.1 U1.47), HEADER (P3.3)
SS: FPGA (J1.1 U1.16), HEADER (P4.3)
USBD_FPGA_N: FPGA (U1.3), HEADER (J5.3 P6.8)
USBD_FPGA_P: FPGA (U1.4), HEADER (J5.4 P6.7)
VSYNC: FPGA (U1.25), HEADER (J3.7 P2.5)
XCLK1: FPGA (U1.35), HEADER (J3.13 P2.8 P3.7)